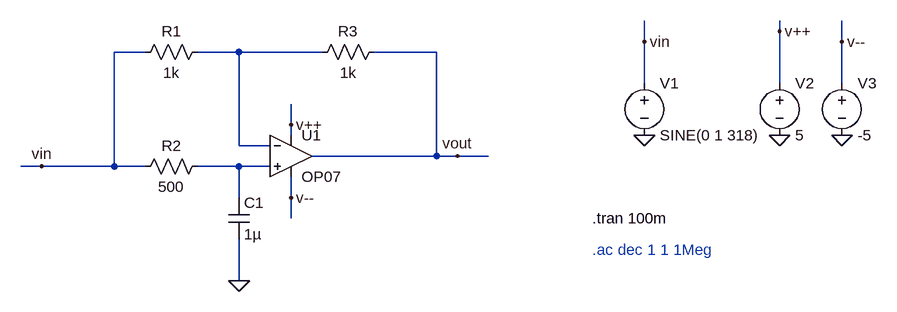
[diagram p0: schematic Time Delayer.asc]
Time Delayer.asc, the LTspice schematic file:
Version 4
SHEET 1 1356 680
WIRE 1200 112 1200 96
WIRE 992 128 992 96
WIRE 1296 128 1296 96
WIRE 224 144 176 144
WIRE 368 144 304 144
WIRE 496 144 368 144
WIRE 672 144 576 144
WIRE 992 192 992 128
WIRE 1200 192 1200 112
WIRE 1296 192 1296 128
WIRE 448 256 448 224
WIRE 448 272 448 256
WIRE 368 288 368 144
WIRE 416 288 368 288
WIRE 672 304 672 144
WIRE 672 304 480 304
WIRE 704 304 672 304
WIRE 752 304 704 304
WIRE 64 320 32 320
WIRE 176 320 176 144
WIRE 176 320 64 320
WIRE 224 320 176 320
WIRE 368 320 304 320
WIRE 416 320 368 320
WIRE 368 368 368 320
WIRE 448 368 448 336
WIRE 448 400 448 368
WIRE 368 496 368 432
FLAG 368 496 0
FLAG 448 368 v--
FLAG 448 256 v++
FLAG 64 320 vin
FLAG 704 304 vout
FLAG 992 272 0
FLAG 1200 272 0
FLAG 1296 272 0
FLAG 992 128 vin
FLAG 1200 112 v++
FLAG 1296 128 v--
SYMBOL Opamps/OP07 448 240 R0
SYMATTR InstName U1
SYMBOL res 320 128 R90
WINDOW 0 0 56 VBottom 2
WINDOW 3 32 56 VTop 2
SYMATTR InstName R1
SYMATTR Value 1k
SYMBOL res 320 304 R90
WINDOW 0 0 56 VBottom 2
WINDOW 3 32 56 VTop 2
SYMATTR InstName R2
SYMATTR Value 500
SYMBOL res 592 128 R90
WINDOW 0 0 56 VBottom 2
WINDOW 3 32 56 VTop 2
SYMATTR InstName R3
SYMATTR Value 1k
SYMBOL cap 352 368 R0
SYMATTR InstName C1
SYMATTR Value 1µ
SYMBOL voltage 992 176 R0
SYMATTR InstName V1
SYMATTR Value SINE(0 1 318)
SYMATTR Value2 AC 1
SYMBOL voltage 1200 176 R0
SYMATTR InstName V2
SYMATTR Value 5
SYMBOL voltage 1296 176 R0
SYMATTR InstName V3
SYMATTR Value -5
TEXT 912 400 Left 2 !.tran 100m
TEXT 912 448 Left 2 ;.ac dec 1 1 1Meg

The netlist it stands for:
* Time Delayer.asc
XU1 N002 N001 v++ v-- vout LT1001  ; OP07, pins In+ In- V+ V- OUT
R1 N001 vin 1k
R2 N002 vin 500
R3 vout N001 1k
C1 N002 0 1µ
V1 vin 0 SINE(0 1 318) AC 1
V2 v++ 0 5
V3 v-- 0 -5
.tran 100m
* .ac dec 1 1 1Meg
.lib LTC.lib
.backanno
.end